# Altium schematic sheet Measurements.SchDoc
size A4; SheetNumber: 17; SheetTotal: 18
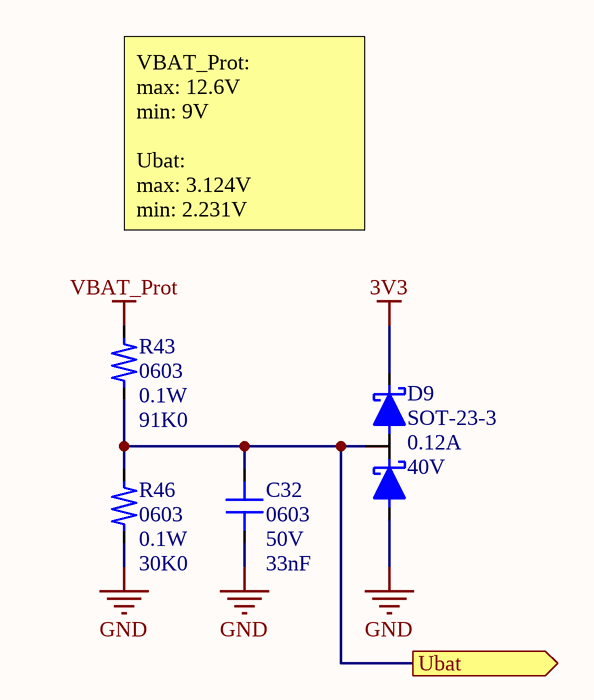
[diagram p0: Measurements.SchDoc]

## Parts
C32  0603  value 33nF  Rating: 50V  [C_0603]
D9  SOT-23-3  value 40V  Rating: 0.12A  [SOT-23-3]
R43  0603  value 91K0  Rating: 0.1W  [R_0603]
R46  0603  value 30K0  Rating: 0.1W  [R_0603]

## Ports
Ubat (out)

## Nets
3V3: D9.2(DC)
GND: C32.1(C1) D9.1(DA) R46.1(R1)
VBAT_Prot: R43.2(R2)
Ubat: C32.2(C2) D9.3(DCA) R43.1(R1) R46.2(R2) ; port Ubat

## Notes on the sheet
- VBAT_Prot:
  max: 12.6V
  min: 9V
  Ubat:
  max: 3.124V
  min: 2.231V

## Library data of the parts
C32 = CL10B333KB8NNNC: NI Part Number: 716045-01; Type: Chip Capacitor; Tolerance: 10%; ID: Cap_0603_33nF_50V_Chip; NI PEN/DEB: DEB; Part Number: CL10B333KB8NNNC; Order Number: 82-09-36; Distributor: Lomex; Link: http://lomex.hu/hu/webshop/#/page,0/search,82-09-36/stype,1/sidx,1; Price (HUF): 2.00; Package: 0603
D9 = Dio_SOT-23-3_40V_0.12A_Schottky_Series: Part Number: BAS40-04; Type: Schottky Dual Diode; Distributor: Lomex; Link: http://lomex.hu/hu/webshop/#/page,0/search,83-02-49/stype,1/sidx,1; Order Number: 83-02-49; Package: SOT-23-3; Price (HUF): 8; ID: Dio_SOT-23-3_40V_0.12A_Schottky_Series; NI part number: -; NI PEN/DEB: -
R43 = CR-03FL7---91K: NI part number: 612775-01; Tolerance: 1%; Note: NI: 90.9k; ID: Res_0603_91K0_0.1W_Chip; NI PEN/DEB: PEN; Type: Chip Resistor; Part Number: CR-03FL7---91K; Order Number: 80-14-58; Distributor: Lomex; Link: http://lomex.hu/hu/webshop/#/page,0/search,80-14-58/stype,1/sidx,1; Price (HUF): 0.80; Package: 0603
R46 = CR-03FL7---30K: NI part number: 612699-01; Tolerance: 1%; Note: NI: not in stock; ID: Res_0603_30K0_0.1W_Chip; NI PEN/DEB: DEB; Type: Chip Resistor; Part Number: CR-03FL7---30K; Order Number: 80-14-53; Distributor: Lomex; Link: http://lomex.hu/hu/webshop/#/page,0/search,80-14-53/stype,1/sidx,1; Price (HUF): 0.80; Package: 0603